# EAGLE design Schematic (EAGLE 9.5.1)
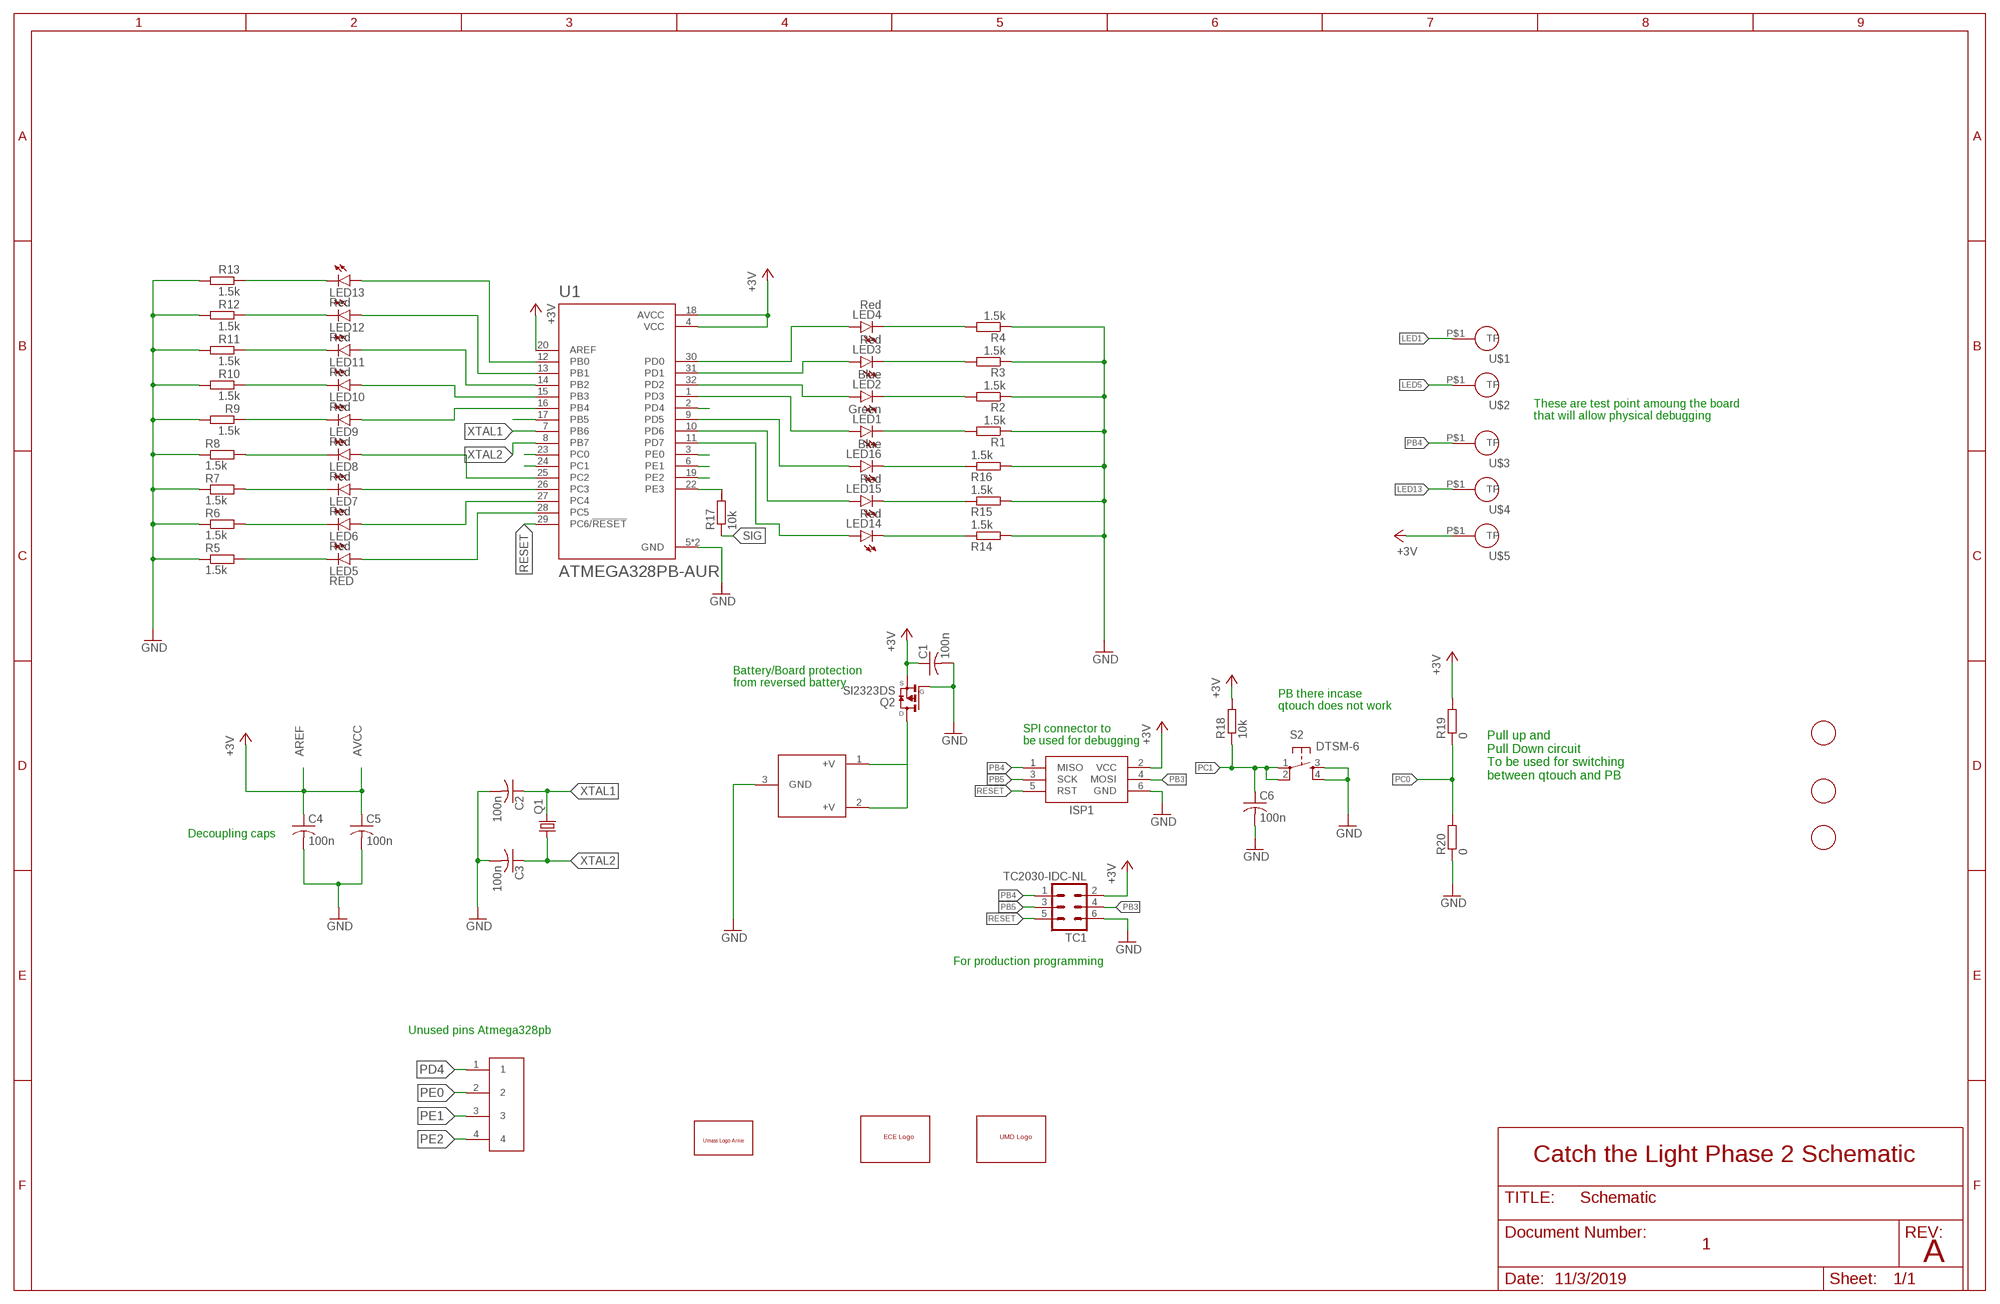
[diagram p0: schematic, sheet 1]

## Parts
C1  100n  C-USC0805  [C0805]
C2  100n  C-USC0805  [C0805]
C3  100n  C-USC0805  [C0805]
C4  100n  C-USC0805  [C0805]
C5  100n  C-USC0805  [C0805]
C6  100n  C-USC0805  [C0805]
CR2032  BC-2003SMD  [BC-2003]
ISP1  AVRISP-6  [AVRISP]
LED1  Green  LEDCHIP-LED0805  [CHIP-LED0805]
LED2  Blue  LEDCHIP-LED0805  [CHIP-LED0805]
LED3  Red  LEDCHIP-LED0805  [CHIP-LED0805]
LED4  Red  LEDCHIP-LED0805  [CHIP-LED0805]
LED5  RED  LEDCHIP-LED0805  [CHIP-LED0805]
LED6  Red  LEDCHIP-LED0805  [CHIP-LED0805]
LED7  Red  LEDCHIP-LED0805  [CHIP-LED0805]
LED8  Red  LEDCHIP-LED0805  [CHIP-LED0805]
LED9  Red  LEDCHIP-LED0805  [CHIP-LED0805]
LED10  Red  LEDCHIP-LED0805  [CHIP-LED0805]
LED11  Red  LEDCHIP-LED0805  [CHIP-LED0805]
LED12  Red  LEDCHIP-LED0805  [CHIP-LED0805]
LED13  Red  LEDCHIP-LED0805  [CHIP-LED0805]
LED14  Red  LEDCHIP-LED0805  [CHIP-LED0805]
LED15  Red  LEDCHIP-LED0805  [CHIP-LED0805]
LED16  Blue  LEDCHIP-LED0805  [CHIP-LED0805]
Q1  CRYSTALHC49UP  [HC49UP]
Q2  SI2323DS  [SOT23]
R1  1.5k  R-EU_R0805  [R0805]
R2  1.5k  R-EU_R0805  [R0805]
R3  1.5k  R-EU_R0805  [R0805]
R4  1.5k  R-EU_R0805  [R0805]
R5  1.5k  R-EU_R0805  [R0805]
R6  1.5k  R-EU_R0805  [R0805]
R7  1.5k  R-EU_R0805  [R0805]
R8  1.5k  R-EU_R0805  [R0805]
R9  1.5k  R-EU_R0805  [R0805]
R10  1.5k  R-EU_R0805  [R0805]
R11  1.5k  R-EU_R0805  [R0805]
R12  1.5k  R-EU_R0805  [R0805]
R13  1.5k  R-EU_R0805  [R0805]
R14  1.5k  R-EU_R0805  [R0805]
R15  1.5k  R-EU_R0805  [R0805]
R16  1.5k  R-EU_R0805  [R0805]
R17  10k  R-EU_R0805  [R0805]
R18  10k  R-EU_R0805  [R0805]
R19  0  R-EU_R0805  [R0805]
R20  0  R-EU_R0805  [R0805]
S2  DTSM-6  [DTSM-6]
TC1  TC2030-IDC-NL  [TC2030-IDC-NL]
U1  ATMEGA328PB-AUR  [QFP80P900X900X120-32N]
U$1  TEST_POINT  [TEST_POINT]
U$2  TEST_POINT  [TEST_POINT]
U$3  TEST_POINT  [TEST_POINT]
U$4  TEST_POINT  [TEST_POINT]
U$5  TEST_POINT  [TEST_POINT]
U$6  PINHEADER  [HEADERPIN]
U$7  FIDUCIAL  [FIDUCIAL_1MM]
U$8  FIDUCIAL  [FIDUCIAL_1MM]
U$9  FIDUCIAL  [FIDUCIAL_1MM]
U$10  UMASSLGOARNIE  [UMASSLOGOARNIE]
U$11  ECE_LOGO  [ECE]
U$12  UMDLOGO  [UMDLOGO]

## Nets
+3V3: C1.1 C4.1 C5.1 ISP1.2(VCC) Q2.2(S) R18.2 R19.2 TC1.2 U1.4(VCC) U1.18(AVCC) U1.20(AREF) U$5.P$1(TP) ; supply symbol labelled +3V
GND: C1.2 C2.2 C3.2 C4.2 C5.2 C6.2 CR2032.3(GND) ISP1.6(GND) Q2.1(G) R1.1 R2.1 R3.1 R4.1 R5.1 R6.1 R7.1 R8.1 R9.2 R10.2 R11.2 R12.2 R13.2 R14.2 R15.2 R16.2 R20.1 S2.3 S2.4 TC1.6 U1.5(GND) U1.21(GND)
LED1: LED1.A U1.1(PD3) U$1.P$1(TP)
LED5: LED5.A U1.28(PC5) U$2.P$1(TP)
LED12: LED12.A U1.13(PB1)
LED13: LED13.A U1.12(PB0) U$4.P$1(TP)
N$1: LED5.C R5.2
N$2: CR2032.1(+V) CR2032.2(+V) Q2.3(D)
N$4: LED11.A U1.14(PB2)
N$5: LED6.A U1.27(PC4)
N$7: LED8.A U1.25(PC2)
N$8: LED7.A U1.26(PC3)
N$9: LED4.A U1.30(PD0)
N$10: LED3.A U1.31(PD1)
N$11: LED2.A U1.32(PD2)
N$13: LED16.A U1.9(PD5)
N$14: LED15.A U1.10(PD6)
N$15: LED14.A U1.11(PD7)
N$32: LED9.C R9.1
N$33: R17.2 U1.22(PE3)
N$34: LED8.C R8.2
N$35: LED7.C R7.2
N$36: LED6.C R6.2
N$38: LED4.C R4.2
N$39: LED3.C R3.2
N$40: LED2.C R2.2
N$41: LED1.C R1.2
N$42: LED10.C R10.1
N$43: LED11.C R11.1
N$44: LED12.C R12.1
N$45: LED13.C R13.1
N$46: LED14.C R14.1
N$47: LED15.C R15.1
N$48: LED16.C R16.1
PB3: ISP1.4(MOSI) LED10.A TC1.4 U1.15(PB3)
PB4: ISP1.1(MISO) LED9.A TC1.1 U1.16(PB4) U$3.P$1(TP)
PB5: ISP1.3(SCK) TC1.3 U1.17(PB5)
PC0: R19.1 R20.2 U1.23(PC0)
PC1: C6.1 R18.1 S2.1 S2.2 U1.24(PC1)
PD4: U1.2(PD4) U$6.1
PE0: U1.3(PE0) U$6.2
PE1: U1.6(PE1) U$6.3
PE2: U1.19(PE2) U$6.4
RESET: ISP1.5(RST) TC1.5 U1.29(PC6/!RESET)
SIG: R17.1
XTAL1: C2.1 Q1.2 U1.7(PB6)
XTAL2: C3.1 Q1.1 U1.8(PB7)

## Notes on the sheet
- These are test point amoung the board 
  that will allow physical debugging
- Battery/Board protection 
  from reversed battery
- PB there incase 
  qtouch does not work
- SPI connector to 
  be used for debugging
- AREF | AVCC
- Pull up and 
  Pull Down circuit
  To be used for switching 
  between qtouch and PB
- Decoupling caps
- For production programming
- Unused pins Atmega328pb
- Catch the Light Phase 2 Schematic
- 1
- A
- 11/3/2019

## Library data of the parts
C1-C6 = rcl:C-US: CAPACITOR, American symbol; SPICEPREFIX: C
CR2032 = My-library_:BC-2003: Batter Holder for the following: BR2032, CR2032, DL2032, LIR2032, BR2025, CR2025, DL2025, LIR2025
ISP1 = adafruit:AVRISP: AVR ISP HEADER Standard 6 pin header for AVR programming
LED1-LED16 = led:LED: LED OSRAM: - CHIPLED LG R971, LG N971, LY N971, LG Q971, LY Q971, LO R971, LY R971 LH N974, LH R974 LS Q976, LO Q976, LY Q976 LO Q996 - Hyper CHIPLED LW Q18S LB Q993, LB Q99A, LB R99A - SideLED LS A670, LO A670, LY A670, LG A670, LP A670 LB A673, LV A673, LT A673, LW A673 LH A674 LY A675 LS A676, LA A676, LO A676, LY A676, LW A676 LS A679, LY A679, LG A679 - Hyper Micro SIDELED® LS Y876, LA Y876, LO Y876, LY Y876 LT Y87S - SmartLED LW L88C, LW L88S LB L89C, LB L89S, LG L890 LS L89K, LO L89K, LY L89K LS L896, LA L896, LO L896, LY L896 - TOPLED LS T670, LO T670, LY T670, LG T670, LP T670 LSG T670, LSP T670, LSY T670, LOP T670, LYG T670 LG T671, LOG T671, LSG T671 LB T673, LV T673, LT T673, LW T673 LH T674 LS T676, LA T676, LO T676, LY T676, LB T676, LH T676, LSB T676, LW T676 LB T67C, LV T67C, LT T67C, LS T67K, LO T67K, LY T67K, LW E67C LS E67B, LA E67B, LO E67B, LY E67B, LB E67C, LV E67C, LT E67C LW T67C LS T679, LY T679, LG T679 LS T770, LO T770, LY T770, LG T770, LP T770 LB T773, LV T773, LT T773, LW T773 LH T774 LS E675, LA E675, LY E675, LS T675 LS T776, LA T776, LO T776, LY T776, LB T776 LHGB T686 LT T68C, LB T68C - Hyper Mini TOPLED® LB M676 - Mini TOPLED Santana® LG M470 LS M47K, LO M47K, LY M47K Source: http://www.osram.convergy.de LUXEON: - LUMILED® LXK2-PW12-R00, LXK2-PW12-S00, LXK2-PW14-U00, LXK2-PW14-V00 LXK2-PM12-R00, LXK2-PM12-S00, LXK2-PM14-U00 LXK2-PE12-Q00, LXK2-PE12-R00, LXK2-PE12-S00, LXK2-PE14-T00, LXK2-PE14-U00 LXK2-PB12-K00, LXK2-PB12-L00, LXK2-PB12-M00, LXK2-PB14-N00, LXK2-PB14-P00, LXK2-PB14-Q00 LXK2-PR12-L00, LXK2-PR12-M00, LXK2-PR14-Q00, LXK2-PR14-R00 LXK2-PD12-Q00, LXK2-PD12-R00, LXK2-PD12-S00 LXK2-PH12-R00, LXK2-PH12-S00 LXK2-PL12-P00, LXK2-PL12-Q00, LXK2-PL12-R00 Source: www.luxeon.com KINGBRIGHT: KA-3528ASYC Source: www.kingbright.com
Q1 = crystal:CRYSTAL: CRYSTAL; OC_FARNELL: unknown; OC_NEWARK: unknown
Q2 = SI2323DS:SI2323DS: P-Channel MOSFET; AVAILABILITY: Unavailable; MF: Vishay Siliconix; MP: SI2323DS; PACKAGE: SOT-23-3 Vishay; PRICE: None
R1-R20 = rcl:R-EU_: RESISTOR, European symbol; SPICEPREFIX: R
S2 = switch-tact:DTSM-6
TC1 = TagConnect:TC2030-IDC: Tag-Connect In Circuit Programming & Debug Cable 6 Pin http://www.tag-connect.com
U1 = ATMEGA328PB-AUR:ATMEGA328PB-AUR: ATmega Series 20 MHz 32 KB Flash 2 KB SRAM 8-Bit Microcontroller - TQFP-32; DESCRIPTION: AVR microcontroller; EEPROM: 1024B; SRAM: 2kB; Flash: 32kB; TQFP32; DIGI-KEY_PART_NUMBER: ATMEGA328PB-AURCT-ND; DIGI-KEY_PURCHASE_URL: https://www.digikey.com/product-detail/en/microchip-technology/ATMEGA328PB-AUR/ATMEGA328PB-AURCT-ND/5722706?utm_source=snapeda&utm_medium=aggregator&utm_campaign=symbol; MF: Microchip; MP: ATMEGA328PB-AUR; PACKAGE: TQFP-32 Microchip
U$1-U$5 = My-library_:TEST_POINT
U$6 = My-library_:PINHEADER
U$7-U$9 = adafruit:FIDUCIAL: For use by pick and place machines to calibrate the vision/machine, 1mm By microbuilder.eu
U$10 = My-library_:UMASSLGOARNIE
U$11 = My-library_:ECE_LOGO
U$12 = My-library_:UMDLOGO

## Net classes
0 default: clearance 0.205 mm

## Board
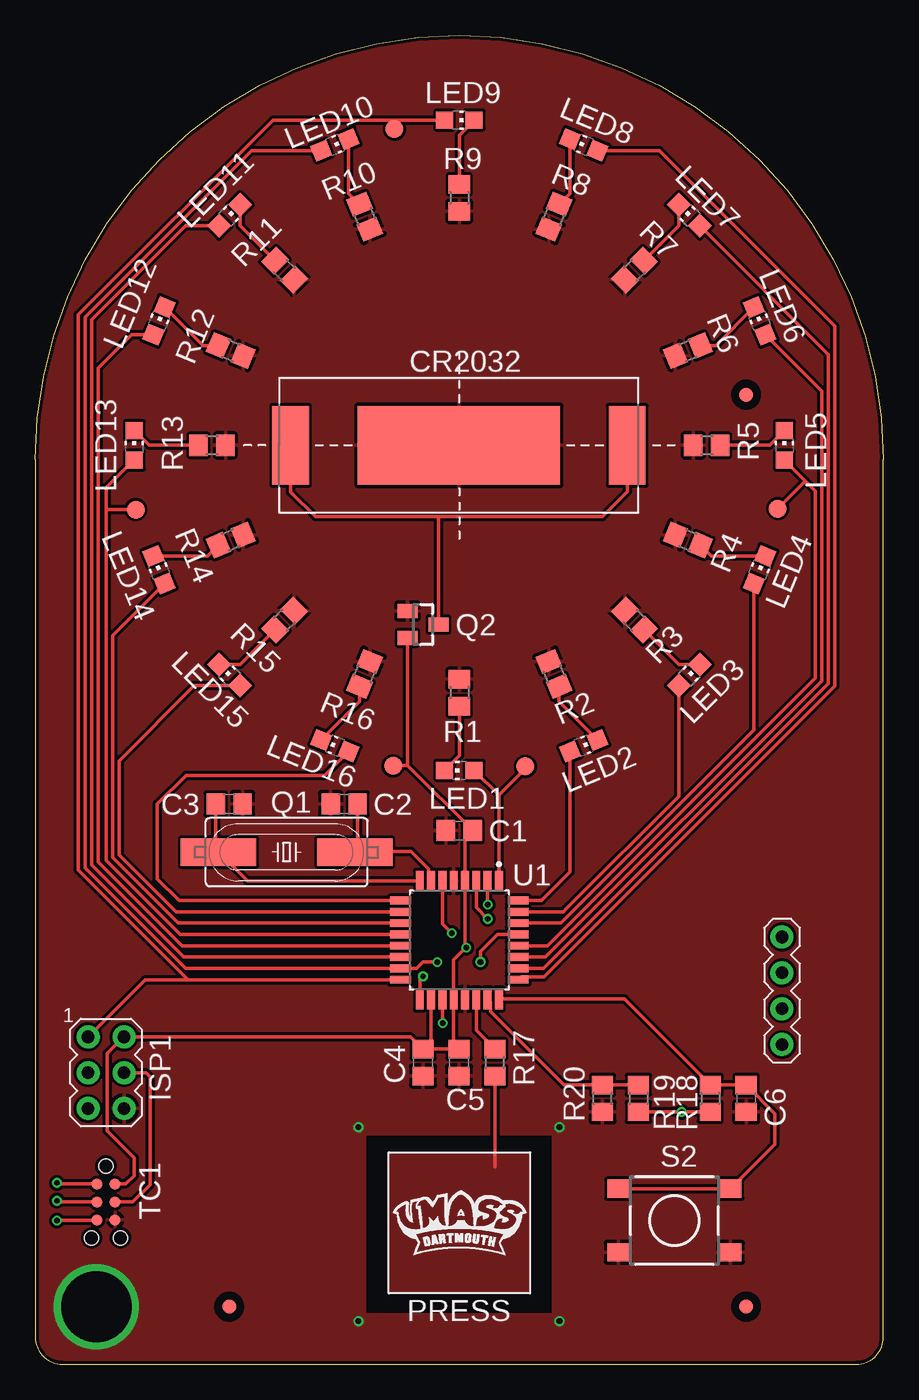
[diagram p1: board, top side]
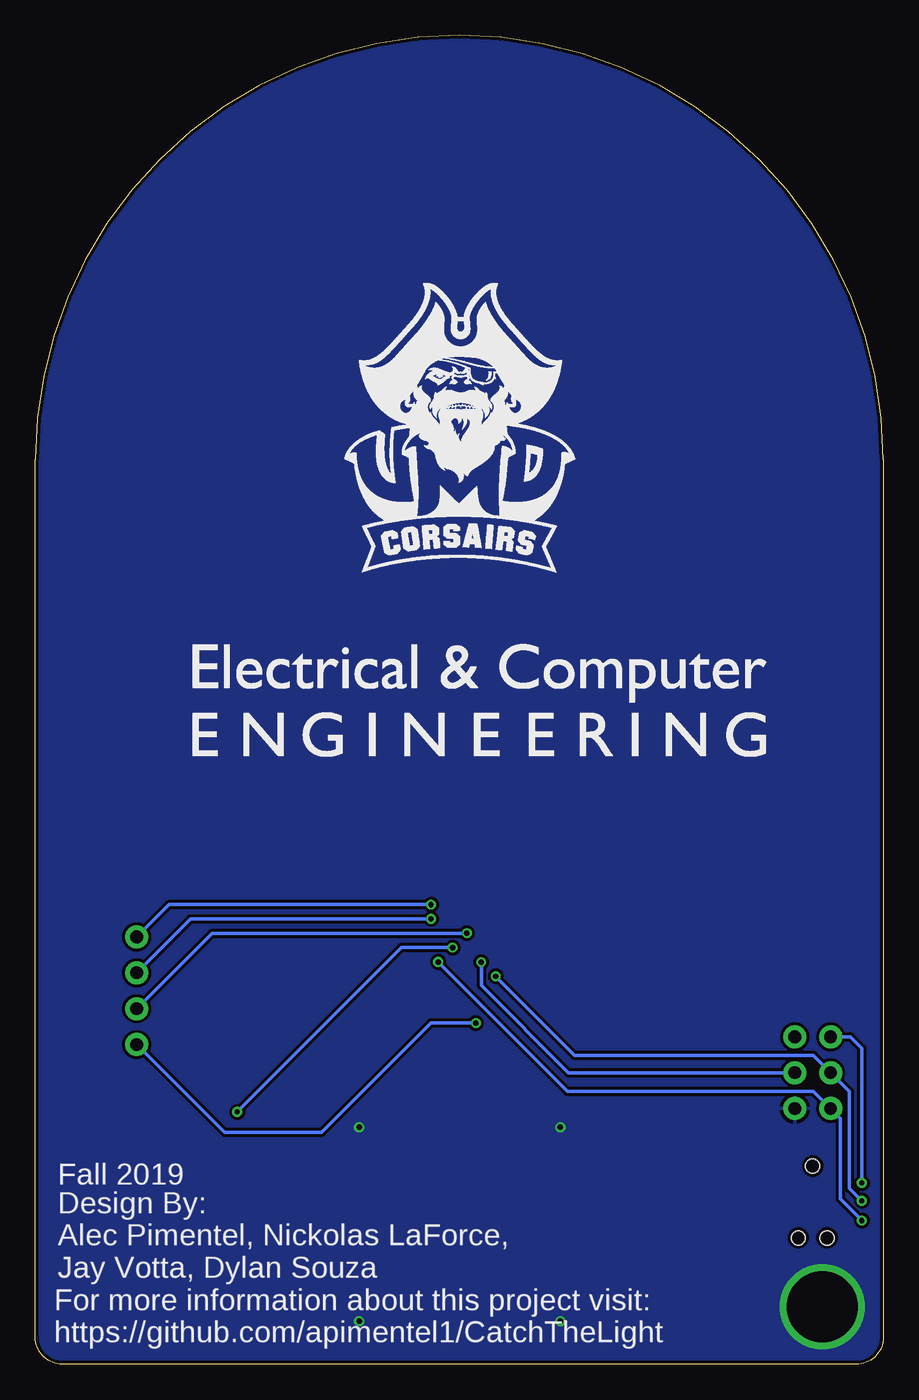
[diagram p2: board, bottom side, seen from below]

Size 60 x 94 mm. Coordinates in mm from the lower left corner, seen from the top.
Outline: 0,64 0,1.91 arc90 1.91,0 58.09,0 arc90 60,1.91 60,64 arc180 0,64
Copper layers (1*16): Top 0.035mm / dielectric 1.5mm / Bottom 0.035mm
Design rules "Dirty8TS": minimum track width 8mil, minimum drill 15mil, track to track 8mil, track to pad 8mil, pad to pad 8mil, via to via 8mil, smd to smd 0mil, copper to edge 10mil, drill to drill 10mil, minimum pad ring 10mil, minimum via ring 6mil, stop-mask expansion 2mil, vias tented up to drill 25mil, thermal gap 10mil
tKeepout: area 20,55 to 40,75

### Footprints (pad centres in the part's own frame; a part is rotated, then mirrored left to right if it is on the bottom)
C0805 = smd 1.3 x 1.5: 1 -0.95,0; 2 0.95,0
BC-2003 = smd 2.6 x 5.56: 1 -11.938,0; 2 11.872,0 | smd 14.32 x 5.56: 3 -0.033,0
AVRISP = drill 0.9 pad 1.626: 1 -1.27,2.54; 2 1.27,2.54; 3 -1.27,0; 4 1.27,0; 5 -1.27,-2.54; 6 1.27,-2.54
CHIP-LED0805 = smd 1.2 x 1.2: A 0,-1.05; C 0,1.05
HC49UP = smd 5.334 x 1.93: 1 -4.826,0; 2 4.826,0
SOT23 = smd 1 x 1.4: 1 -0.95,-1.1; 2 0.95,-1.1; 3 0,1.1
R0805 = smd 1.3 x 1.5: 1 -0.95,0; 2 0.95,0
DTSM-6 = smd 1.55 x 1.3: 1 -3.975,2.25; 2 3.975,2.25; 3 -3.975,-2.25; 4 3.975,-2.25
TC2030-IDC-NL = smd 0.787 x 0.787: 1 -1.27,-0.635; 2 -1.27,0.635; 3 0,-0.635; 4 0,0.635; 5 1.27,-0.635; 6 1.27,0.635 | hole 0.991: -2.54,0; 2.54,1.016; 2.54,-1.016
QFP80P900X900X120-32N = smd 1.47 x 0.55: 1 -4.17,2.8; 2 -4.17,2; 3 -4.17,1.2; 4 -4.17,0.4; 5 -4.17,-0.4; 6 -4.17,-1.2; 7 -4.17,-2; 8 -4.17,-2.8; 17 4.17,-2.8; 18 4.17,-2; 19 4.17,-1.2; 20 4.17,-0.4; 21 4.17,0.4; 22 4.17,1.2; 23 4.17,2; 24 4.17,2.8 | smd 0.55 x 1.47: 9 -2.8,-4.17; 10 -2,-4.17; 11 -1.2,-4.17; 12 -0.4,-4.17; 13 0.4,-4.17; 14 1.2,-4.17; 15 2,-4.17; 16 2.8,-4.17; 25 2.8,4.17; 26 2,4.17; 27 1.2,4.17; 28 0.4,4.17; 29 -0.4,4.17; 30 -1.2,4.17; 31 -2,4.17; 32 -2.8,4.17
TEST_POINT = smd 1.27 x 1.27: P$1 0,0
HEADERPIN = drill 0.9 pad 1.626: 1 0,3.81; 2 0,1.27; 3 0,-1.27; 4 0,-3.81
FIDUCIAL_1MM = smd 1 x 1: 1 0,0

### Placement (x,y rotation side)
C1  30,37.75 180 top
C2  21.84,39.62 180 top
C3  13.72,39.62 0 top
C4  27.43,21.34 270 top
C5  29.97,21.34 270 top
C6  50.29,18.8 270 top
CR2032  30,65 0 top
ISP1  5,20.62 0 top
LED1  30,42 90 top
LED2  38.8,43.75 292.5 top
LED3  46.26,48.74 315 top
LED4  51.25,56.2 337.5 top
LED5  53,65 0 top
LED6  51.25,73.8 22.5 top
LED7  46.26,81.26 45 top
LED8  38.8,86.25 67.5 top
LED9  30,88 270 top
LED10  21.2,86.25 292.5 top
LED11  13.74,81.26 315 top
LED12  8.75,73.8 337.5 top
LED13  7,65 0 top
LED14  8.75,56.2 22.5 top
LED15  13.74,48.74 45 top
LED16  21.2,43.75 67.5 top
Q1  17.78,36.22 0 top
Q2  27.43,52.32 270 top
R1  30,47.5 270 top
R2  36.7,48.83 292.5 top
R3  42.37,52.63 315 top
R4  46.17,58.3 337.5 top
R5  47.5,65 0 top
R6  46.17,71.7 22.5 top
R7  42.37,77.37 45 top
R8  36.7,81.17 67.5 top
R9  30,82.5 270 top
R10  23.3,81.17 292.5 top
R11  17.63,77.37 315 top
R12  13.83,71.7 337.5 top
R13  12.5,65 0 top
R14  13.83,58.3 22.5 top
R15  17.63,52.63 45 top
R16  23.3,48.83 67.5 top
R17  32.51,21.34 90 top
R18  47.75,18.8 270 top
R19  42.67,18.8 270 top
R20  40.13,18.8 90 top
S2  45.21,10.16 0 top
TC1  5,11.47 270 top
U1  30,30 270 top
U$1  34.67,42.29 0 top
U$2  52.53,60.51 0 top
U$3  25.4,87.38 0 top
U$4  7.11,60.45 0 top
U$5  25.31,42.32 180 top
U$6  52.83,26.42 0 top
U$7  13.72,4.06 0 top
U$8  50.29,4.06 0 top
U$9  50.29,68.58 0 top
U$10  30,65 0 bottom
U$11  29.97,46.74 0 bottom
U$12  30.12,9.91 0 top

### Tracks (layer width: path | path; a pad name or v marks a point on that pad's centre or on a via)
+3V3  (via drill 0.38)
  Top 0.254: C4.1 28,22.85 U1.18 | C4.1 C5.1 29.6,22.29 U1.20 29.6,28.58 v30.48,29.46 30.4,29.54 U1.4 30.4,37.2 C1.1 26.33,42.36 | C4.1 26.56,23.16 ISP1.2 5.08,21.97 5.08,16.51 6.99,14.61 6.99,13.34 6.39,12.74 TC1.2 | R19.2 v45.72,17.85 R18.2 | Q2.2 26.33,42.36 | U$5.P$1 25.36,42.36 26.33,42.36
  Bottom 0.254: v30.48,29.46 34.1,29.46 v45.72,17.85
GND  (via drill 0.4, 5)
  other vias: 22.86,16.76 22.86,3.05 37.08,3.05 37.08,16.76 4.32,4.06
  pour Top: 42.67,-2.03 19.81,-2.03 19.81,-1.02 19.81,3.56 42.67,3.56
  pour Bottom: -5.08,-2.03 62.99,-2.03 62.99,2.54 62.99,97.03 44.2,97.03 -5.08,97.03
  pour Top: -4.06,-1.52 23.37,-1.52 23.37,3.56 23.37,16.26 25.4,16.26 36.58,16.26 36.58,15.75 36.58,-1.52 38.1,-1.52 62.48,-1.52 62.48,11.18 62.48,96.52 53.34,96.52 -4.57,96.52 -4.57,90.93 -4.57,-1.52
LED1
  Top 0.254: 32.8,40.25 U1.1 | LED1.A 32.8,40.25 | U$1.P$1 34.67,42.12 32.8,40.25
LED5
  Top 0.254: LED5.A 54.48,62.47 | 54.48,62.47 55.17,61.78 55.17,48.52 36.25,29.6 U1.28 | U$2.P$1 54.48,62.47
LED12
  Top 0.254: U1.13 10.4,29.6 4.46,35.54 4.46,70.46 6.83,72.83 LED12.A
LED13
  Top 0.254: U1.12 10.25,30.4 5,35.65 5,60.45 | 5,60.45 5,62 6.95,63.95 LED13.A | U$4.P$1 5,60.45
N$1
  Top 0.254: R5.2 51.95,65 LED5.C
N$2
  Top 0.254: 28.45,59.94 19.81,59.94 18.06,61.69 CR2032.1 | 28.45,59.94 40.13,59.94 41.91,61.72 41.91,64.97 CR2032.2 | Q2.3 28.53,59.86 28.45,59.94
N$4
  Top 0.254: U1.14 10.5,28.8 4,35.3 4,73.89 10.63,80.52 LED11.A
N$5
  Top 0.254: LED6.A 55.64,68.84 55.64,48.34 36.1,28.8 U1.27
N$7
  Top 0.254: LED8.A 44.15,85.85 56.55,73.44 56.55,47.96 35.99,27.39 34.36,27.39 U1.25
N$8
  Top 0.254: U1.26 35.95,28 56.1,48.15 56.1,71.43 LED7.A
N$9
  Top 0.254: U1.30 37.2,31.2 50.85,44.85 LED4.A
N$10
  Top 0.254: LED3.A 45.52,40.17 37.73,32.38 37.54,32.19 37.35,32 U1.31
N$11
  Top 0.254: U1.32 35.8,32.8 37.83,34.83 LED2.A
N$13
  Top 0.254: U1.9 10.16,32.8 8.64,34.32 8.64,39.62 10.67,41.66 20.48,41.66 LED16.A
N$14
  Top 0.254: U1.10 17.27,32 17,32 9.95,32 5.92,36.03 5.92,42.67 11.24,47.99 LED15.A
N$15
  Top 0.254: U1.11 10.1,31.2 5.46,35.84 5.46,51.53 LED14.A
N$32
  Top 0.254: R9.1 30,86.95 LED9.C
N$33
  Top 0.254: R17.2 31.2,23.6 U1.22
N$34
  Top 0.254: R8.2 37.83,82.82 LED8.C
N$35
  Top 0.254: R7.2 45.52,80.52 LED7.C
N$36
  Top 0.254: R6.2 48.14,72.06 LED6.C
N$38
  Top 0.254: R4.2 47.82,57.17 LED4.C
N$39
  Top 0.254: R3.2 45.52,49.48 LED3.C
N$40
  Top 0.254: R2.2 37.06,46.86 LED2.C
N$41
  Top 0.254: R1.2 30,43.05 LED1.C
N$42
  Top 0.254: R10.1 22.17,82.82 LED10.C
N$43
  Top 0.254: R11.1 16,79 | 16,79 | 16,79 14.48,80.52 LED11.C
N$44
  Top 0.254: R12.1 11.86,72.06 LED12.C
N$45
  Top 0.254: R13.1 8.05,65 LED13.C
N$46
  Top 0.254: R14.1 12.18,57.17 LED14.C
N$47
  Top 0.254: R15.1 14.48,49.48 LED15.C
N$48
  Top 0.254: R16.1 22.94,46.86 LED16.C
PB3  (via drill 0.38)
  Top 0.254: LED10.A 15.31,85.85 3.54,74.08 3.54,35.11 10.65,28 U1.15 26.98,28 27.43,28.45 v28.45,28.45 | ISP1.4 7.83,20.62 8.13,20.32 8.13,12.7 6.9,11.47 TC1.4
  Bottom 0.254: ISP1.4 22.28,20.62 28.45,26.78 v28.45,28.45
PB4  (via drill 0.38)
  Top 0.254: ISP1.1 7.77,27.2 10.8,27.2 | v1.52,12.83 1.61,12.74 TC1.1 | LED9.A 25.4,88 | 25.4,88 16.81,88 3.05,74.24 3.05,34.95 10.8,27.2 | U1.16 10.8,27.2 | U$3.P$1 25.4,88
  Bottom 0.254: ISP1.1 2.33,23.16 1.52,22.35 v1.52,12.83
PB5  (via drill 0.38)
  Top 0.254: U1.17 27.2,27.2 v27.43,27.43 | TC1.3 1.61,11.47 v1.52,11.56
  Bottom 0.254: v27.43,27.43 21.84,21.84 4.96,21.84 ISP1.3 2.41,19.3 2.41,12.45 v1.52,11.56
PC0
  Top 0.254: U1.23 32.19,25.64 32.19,24.96 37.4,19.75 R20.2 R19.1
PC1
  Top 0.254: U1.24 41.67,25.83 R18.1 C6.1 52.32,17.71 52.32,15.55 S2.2 S2.1
PD4  (via drill 0.38)
  Top 0.254: U1.2 v32,32.51
  Bottom 0.254: v32,32.51 50.55,32.51 U$6.1
PE0  (via drill 0.38)
  Top 0.254: U1.3 31.2,32.3 v32,31.5
  Bottom 0.254: v32,31.5 49.02,31.5 U$6.2
PE1  (via drill 0.38)
  Top 0.254: U1.6 28.8,31.14 v29.46,30.48
  Bottom 0.254: v29.46,30.48 47.5,30.48 U$6.3
PE2  (via drill 0.38)
  Top 0.254: U1.19 28.8,24.16 v28.83,24.13
  Bottom 0.254: v28.83,24.13 32,24.13 39.75,16.38 46.61,16.38 U$6.4
RESET  (via drill 0.38, 0.4)
  Top 0.254: U1.29 32.69,30.4 31.5,29.21 v31.5,28.45 | TC1.5 4.32,10.16 v1.52,10.16
  Bottom 0.254: v31.5,28.45 28.7,25.65 22.35,19.3 4.96,19.3 ISP1.5 3.05,17.4 3.05,11.68 v1.52,10.16
SIG
  Top 0.254: R17.1 32.51,16.76 32.51,16.26 32.51,13.97
  pour Top: 25,5 25,15 35,15 35,5
XTAL1
  Top 0.254: C2.1 22.79,36.41 22.66,36.27 | 22.66,36.27 Q1.2 | U1.7 27.81,34.36 27.81,35.04 26.58,36.27 22.66,36.27
XTAL2
  Top 0.254: C3.1 12.77,36.41 Q1.1 15.01,34.17 U1.8

### Text on the board
tPlace: PRESS
bPlace: Fall 2019 | Design By: / Alec Pimentel, Nickolas LaForce, / Jay Votta, Dylan Souza | For more information about this project visit: / https://github.com/apimentel1/CatchTheLight